# Altium schematic sheet FPGA.SchDoc
size A4
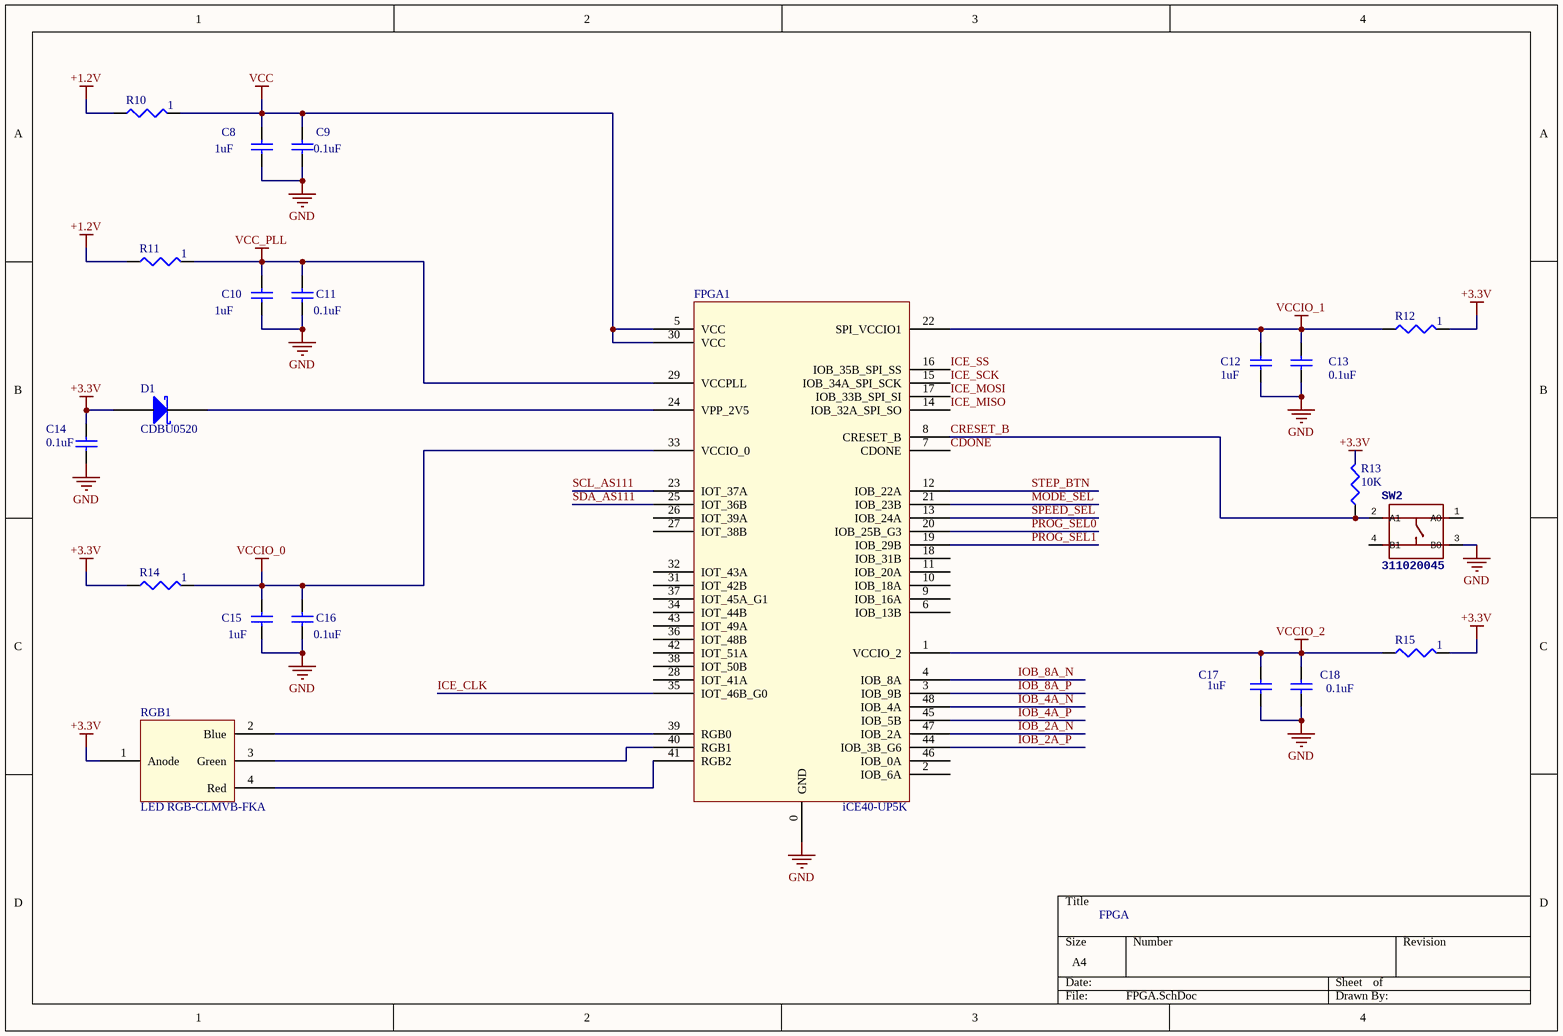
[diagram p0: FPGA.SchDoc]

## Parts
C8  value 1uF  [C0402]  (hidden comment: Cap Semi)
C9  value 0.1uF  [C0402]  (hidden comment: Cap Semi)
C10  value 1uF  [C0402]  (hidden comment: Cap Semi)
C11  value 0.1uF  [C0402]  (hidden comment: Cap Semi)
C12  value 1uF  [C0402]  (hidden comment: Cap Semi)
C13  value 0.1uF  [C0402]  (hidden comment: Cap Semi)
C14  value 0.1uF  [C0402]  (hidden comment: Cap Semi)
C15  value 1uF  [C0402]  (hidden comment: Cap Semi)
C16  value 0.1uF  [C0402]  (hidden comment: Cap Semi)
C17  value 1uF  [C0402]  (hidden comment: Cap Semi)
C18  value 0.1uF  [C0402]  (hidden comment: Cap Semi)
D1  CDBU0520  [CDBU0520]
FPGA1  iCE40-UP5K  [SLAB-QFN48-7X7-MD]
R10  value 1  [R0402]  (hidden comment: Res3)
R11  value 1  [R0402]  (hidden comment: Res3)
R12  value 1  [R0402]  (hidden comment: Res3)
R13  value 10K  [R0402]  (hidden comment: Res3)
R14  value 1  [R0402]  (hidden comment: Res3)
R15  value 1  [R0402]  (hidden comment: Res3)
RGB1  LED RGB-CLMVB-FKA  [ledRGB]
SW2  311020045  [SW4-SMD-4.2X3.2X2.5MM]

## Nets
+1.2V: R10.1 R11.1
+3.3V: C14.2 D1.1 R12.2 R13.2 R14.1 R15.2 RGB1.1(Anode)
GND: C8.1 C9.1 C10.1 C11.1 C12.1 C13.1 C14.1 C15.1 C16.1 C17.1 C18.1 FPGA1.0(GND) SW2.3(B0)
VCC: C8.2 C9.2 FPGA1.5(VCC) FPGA1.30(VCC) R10.2
VCC_PLL: C10.2 C11.2 FPGA1.29(VCCPLL) R11.2
VCCIO_0: C15.2 C16.2 FPGA1.33(VCCIO_0) R14.2
VCCIO_1: C12.2 C13.2 FPGA1.22(SPI_VCCIO1) R12.1
VCCIO_2: C17.2 C18.2 FPGA1.1(VCCIO_2) R15.1
CDONE: FPGA1.7(CDONE)
CRESET_B: FPGA1.8(CRESET_B) R13.1 SW2.2(A1)
ICE_CLK: FPGA1.35(IOT_46B_G0)
ICE_MISO: FPGA1.14(IOB_32A_SPI_SO)
ICE_MOSI: FPGA1.17(IOB_33B_SPI_SI)
ICE_SCK: FPGA1.15(IOB_34A_SPI_SCK)
ICE_SS: FPGA1.16(IOB_35B_SPI_SS)
IOB_2A_N: FPGA1.47(IOB_2A)
IOB_2A_P: FPGA1.44(IOB_3B_G6)
IOB_4A_N: FPGA1.48(IOB_4A)
IOB_4A_P: FPGA1.45(IOB_5B)
IOB_8A_N: FPGA1.4(IOB_8A)
IOB_8A_P: FPGA1.3(IOB_9B)
MODE_SEL: FPGA1.21(IOB_23B)
PROG_SEL0: FPGA1.20(IOB_25B_G3)
PROG_SEL1: FPGA1.19(IOB_29B)
SCL_AS111: FPGA1.23(IOT_37A)
SDA_AS111: FPGA1.25(IOT_36B)
SPEED_SEL: FPGA1.13(IOB_24A)
STEP_BTN: FPGA1.12(IOB_22A)
NetD1_2: D1.2 FPGA1.24(VPP_2V5)
NetFPGA1_39: FPGA1.39(RGB0) RGB1.2(Blue)
NetFPGA1_40: FPGA1.40(RGB1) RGB1.3(Green)
NetFPGA1_41: FPGA1.41(RGB2) RGB1.4(Red)

Not connected (* = marked no-connect by the designer): FPGA1 2(IOB_6A) 6(IOB_13B) 9(IOB_16A) 10(IOB_18A) 11(IOB_20A) 18(IOB_31B) 26(IOT_39A) 27(IOT_38B) 28(IOT_41A) 31(IOT_42B) 32(IOT_43A) 34(IOT_44B) 36(IOT_48B) 37(IOT_45A_G1) 38(IOT_50B) 42(IOT_51A) 43(IOT_49A) 46(IOB_0A); SW2 1(A0) 4(B1)

## Notes on the sheet
- FPGA

## Library data of the parts
C8 C10 C12 C15 C17 = Cap Semi: Capacitor (Semiconductor SIM Model); Manufacturer: TDK Corporation; Manufacturer Part Number: CGB2A1JB1E105M033BC; Tolerance: ±20%; Voltage - Rated: 25V; Temperature Coefficient: JB; Notification: Current market demand for these product types have resulted in fluctuating and extending lead times. Lead times may differ.; Published: 8-Jun-2000; LatestRevisionDate: 29-May-2009; LatestRevisionNote: IPC-7351 Footprint Added.; PackageReference: C1206; Publisher: Altium Limited; PackageDescription: Chip Capacitor; Supplier 1: Digi-Key; Supplier Part Number 1: 445-12016-1-ND; RoHS: RoHS Compliant; Category: Capacitors; Stock 1: 0; Pricing 1: 1=0.25, 10=0.173, 100=0.0874, 500=0.0598, 1000=0.0529, 2500=0.0506, 5000=0.046 (USD); Packaging: Cut Tape (CT); Part Status: Active; Operating Temperature: -25°C ~ 85°C; Features: Low Profile; Ratings: -; Applications: General Purpose; Failure Rate: -; Mounting Type: Surface Mount, MLCC; Package / Case: 0402 (1005 Metric); Size / Dimension: 0.039" L x 0.020" W (1.00mm x 0.50mm); Height - Seated (Max): -; Thickness (Max): 0.013" (0.33mm); Lead Spacing: -; Lead Style: -; ComponentLink1URL: https://product.tdk.com/info/en/catalog/datasheets/mlcc_commercial_lowprofile_en.pdf; ComponentLink1Description: https://product.tdk.com/info/en/catalog/datasheets/mlcc_commercial_lowprofile_en.pdf
C9 C11 C13 C14 C16 C18 = Cap Semi: Capacitor (Semiconductor SIM Model); Manufacturer: Samsung Electro-Mechanics; Manufacturer Part Number: CL05B104KA5NNNC; Tolerance: ±10%; Voltage - Rated: 25V; Temperature Coefficient: X7R; Notification: Current market demand for these product types have resulted in fluctuating and extending lead times. Lead times may differ.; Published: 8-Jun-2000; LatestRevisionDate: 29-May-2009; LatestRevisionNote: IPC-7351 Footprint Added.; PackageReference: C1206; Publisher: Altium Limited; PackageDescription: Chip Capacitor; Supplier 1: Digi-Key; Supplier Part Number 1: 1276-6720-1-ND; RoHS: RoHS Compliant; Category: Capacitors; Stock 1: 0; Pricing 1: 1=0.1, 10=0.071, 100=0.0317, 500=0.02262, 1000=0.01777, 2500=0.01616, 5000=0.01486 (USD); Packaging: Cut Tape (CT); Part Status: Active; Operating Temperature: -55°C ~ 125°C; Features: -; Ratings: -; Applications: General Purpose; Mounting Type: Surface Mount, MLCC; Package / Case: 0402 (1005 Metric); Size / Dimension: 0.039" L x 0.020" W (1.00mm x 0.50mm); Height - Seated (Max): -; Thickness (Max): 0.022" (0.55mm); Lead Spacing: -; Lead Style: -; ComponentLink1URL: http://www.samsungsem.com/kr/support/product-search/mlcc/CL05B104KA5NNNC.jsp; ComponentLink1Description: http://www.samsungsem.com/kr/support/product-search/mlcc/CL05B104KA5NNNC.jsp
D1 = CDBU0520: DIODE SCHOTTKY 20V 500MA 0603; pin to pad: 1>+ 2>-; Manufacturer: Comchip Technology; Speed: Fast Recovery =< 500ns, > 200mA (Io); Capacitance @ Vr, F: 100pF @ 0V, 1MHz; Packaging: Cut Tape (CT); Base Part Number: CDBU0520; Operating Temperature - Junction: 125°C (Max); Category: Discrete Semiconductor Products; Diode Type: Schottky; Supplier Device Package: 0603/SOD-523F; Package / Case: 2-SMD, No Lead; Mounting Type: Surface Mount; Manufacturer Part Number: CDBU0520; RoHS: RoHS Compliant; Part Status: Active; Current - Average Rectified (Io): 500mA; ComponentLink1URL: http://www.comchiptech.com/admin/files/product/CDBU0520-HF-RevA797161.pdf; ComponentLink1Description: http://www.comchiptech.com/admin/files/product/CDBU0520-HF-RevA797161.pdf; Supplier 1: Digi-Key; Stock 1: 262344; Pricing 1: 1=0.47, 10=0.333, 100=0.2186, 500=0.12916, 1000=0.09935 (USD); Supplier Part Number 1: 641-1332-1-ND
FPGA1 = iCE40-UP5K FPGA: Manufacturer: Lattice Semiconductor Corporation; Manufacturer Part Number: ICE40UP5K-SG48ITR50; Voltage - Supply: 1.14 V ~ 1.26 V; Mounting Type: Surface Mount; Category: Integrated Circuits (ICs); Package / Case: 48-VFQFN Exposed Pad; Operating Temperature: -40°C ~ 100°C (TJ); Part Status: Discontinued at Digi-Key; RoHS: RoHS Compliant; Supplier Device Package: 48-QFN (7x7); ComponentLink1URL: http://www.latticesemi.com/view_document?document_id=51968; ComponentLink1Description: http://www.latticesemi.com/view_document?document_id=51968; Stock 1: 514; Supplier 1: Digi-Key; Pricing 1: 1=6.06 (USD); Supplier Part Number 1: 220-2145-1-ND
R10-R12 R14 R15 = Res3: Resistor; Manufacturer: Yageo; Manufacturer Part Number: AC0402JR-071RL; Tolerance: ±5%; Power (Watts): 0.063W, 1/16W; Temperature Coefficient: ±200ppm/°C; Published: 8-Jun-2000; LatestRevisionDate: 29-May-2009; LatestRevisionNote: IPC-7351 Footprint Added.; PackageReference: J1-0603; Publisher: Altium Limited; PackageDescription: Chip Resistor; Supplier 1: Digi-Key; Supplier Part Number 1: YAG3527CT-ND; RoHS: RoHS Compliant; Category: Resistors; Stock 1: 19312; Pricing 1: 1=0.1, 10=0.026, 100=0.0104, 1000=0.00469, 2500=0.00407, 5000=0.00336 (USD); Packaging: Cut Tape (CT); Part Status: Active; Composition: Thick Film; Features: Automotive AEC-Q200, Moisture Resistant; Operating Temperature: -55°C ~ 155°C; Package / Case: 0402 (1005 Metric); Supplier Device Package: 0402; Size / Dimension: 0.039" L x 0.020" W (1.00mm x 0.50mm); Height - Seated (Max): 0.015" (0.37mm); Failure Rate: -; ComponentLink1URL: http://www.yageo.com/NewPortal/yageodocoutput?fileName=/pdf/R-Chip/PYu-AC_51_RoHS_L_6.pdf; ComponentLink1Description: http://www.yageo.com/NewPortal/yageodocoutput?fileName=/pdf/R-Chip/PYu-AC_51_RoHS_L_6.pdf
R13 = Res3: Resistor; Manufacturer: Yageo; Manufacturer Part Number: RC0402JR-0710KP; Tolerance: ±5%; Power (Watts): 0.063W, 1/16W; Temperature Coefficient: ±150ppm/°C; Published: 8-Jun-2000; LatestRevisionDate: 29-May-2009; LatestRevisionNote: IPC-7351 Footprint Added.; PackageReference: J1-0603; Publisher: Altium Limited; PackageDescription: Chip Resistor; Supplier 1: Digi-Key; Supplier Part Number 1: YAG1281CT-ND; RoHS: RoHS Compliant; Category: Resistors; Stock 1: 0; Pricing 1: 1=0.1, 10=0.028, 100=0.0119, 1000=0.00557, 2500=0.0049, 5000=0.00411 (USD); Packaging: Cut Tape (CT); Part Status: Active; Composition: Thick Film; Features: Moisture Resistant; Operating Temperature: -55°C ~ 155°C; Package / Case: 0402 (1005 Metric); Supplier Device Package: 0402; Size / Dimension: 0.039" L x 0.020" W (1.00mm x 0.50mm); Height - Seated (Max): 0.016" (0.40mm); Failure Rate: -; ComponentLink1URL: http://www.yageo.com/NewPortal/yageodocoutput?fileName=/pdf/R-Chip/PYu-RC_51_RoHS_P_0.pdf; ComponentLink1Description: http://www.yageo.com/NewPortal/yageodocoutput?fileName=/pdf/R-Chip/PYu-RC_51_RoHS_P_0.pdf
RGB1 = LED RGB-CLMVB-FKA: LED RGB CLEAR 4PLCC SMD; Manufacturer: Cree Inc.; Manufacturer Part Number: CLMVC-FKA-CL1D1L71BB7C3C3; Configuration: Common Anode; Lens Color: Colorless; Millicandela Rating: 337mcd Red, 420mcd Green, 84mcd Blue; Lens Style: Square with Flat Top; Voltage - Forward (Vf) (Typ): 2V Red, 3V Green, 3V Blue; Current - Test: 20mA Red, 10mA Green, 10mA Blue; Wavelength - Dominant: 622nm Red, 530nm Green, 470nm Blue; Supplier 1: Digi-Key; RoHS: RoHS Compliant; Category: Optoelectronics; Stock 1: 3423; Packaging: Cut Tape (CT); Part Status: Active; Color: Red, Green, Blue (RGB); Lens Transparency: Clear; Lens Size: -; Viewing Angle: -; Mounting Type: Surface Mount; Wavelength - Peak: -; Features: -; Package / Case: 4-SMD, J-Lead; Supplier Device Package: 4-PLCC; Size / Dimension: 2.00mm L x 2.00mm W; Height (Max): 1.00mm; ComponentLink1URL: https://www.cree.com/led-components/media/documents/1273-CLMVC-FKA.pdf; ComponentLink1Description: https://www.cree.com/led-components/media/documents/1273-CLMVC-FKA.pdf; Supplier Part Number 1: CLMVC-FKA-CL1D1L71BB7C3C3CT-ND; Pricing 1: 1=0.19, 10=0.178, 100=0.165, 1000=0.14746 (USD)
SW2 = PTS810 SJM 250 SMTR LFS: SWITCH TACTILE SPST-NO 0.05A 16V; MPN: DHT-4235A; Manufacturer: C&K; Manufacturer Part Number: KXT 331 LHS; Switch Function: Off-Mom; Contact Rating @ Voltage: 0.02A @ 15VDC; Actuator Type: Standard; Actuator Height off PCB, Vertical: 0.60mm; Actuator Orientation: Top Actuated; Outline: 3.00mm x 2.00mm; Illumination: Non-Illuminated; Operating Force: 240gf; Switch Travel: 0.13mm; Mechanical Life: 500,000 Cycles; Supplier 1: Digi-Key; RoHS: RoHS Compliant; Category: Switches; Stock 1: 220949; Packaging: Cut Tape (CT); Part Status: Active; Circuit: SPST-NO; Mounting Type: Surface Mount; Actuator Length, Right Angle: -; Termination Style: SMD (SMT) Tab; Illumination Type, Color: -; Illumination Voltage (Nominal): -; Ingress Protection: -; Features: -; Operating Temperature: -40°C ~ 85°C; Actuator Material: -; ComponentLink1URL: https://www.ckswitches.com/media/1465/kxt3.pdf; ComponentLink1Description: https://www.ckswitches.com/media/1465/kxt3.pdf; Supplier Part Number 1: CKN10502CT-ND; Pricing 1: 1=0.3, 10=0.287, 25=0.2768, 50=0.267, 100=0.2521, 250=0.23728, 500=0.2274, 1000=0.17302 (USD); ComponentLink2URL: https://www.ckswitches.com/media/1476/pts810.pdf; ComponentLink2Description: https://www.ckswitches.com/media/1476/pts810.pdf